# Altium project 3xVCO SMT.PrjPcb
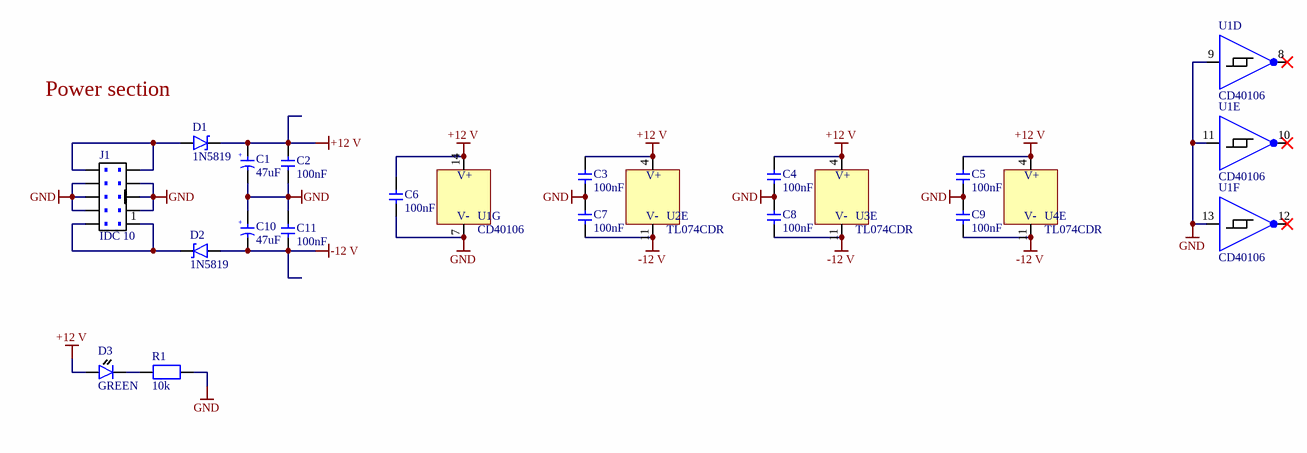
[diagram p0: Power section.SchDoc]
4 sheets, 122 parts. Net scope: global (net labels, ports and power ports of the same name join across sheets).
Board files: 3xVCO.PcbDoc, FrontPanel.PcbDoc
Sheets:
  Power section.SchDoc
  Saw VCO.SchDoc
  Blend VCO.SchDoc
  Triangle VCO.SchDoc

## Sheet Power section.SchDoc: 3x_VCO_board
size A3; Author: Jakub Orzechowski; Revision: 1.0; SheetNumber: 1; SheetTotal: 4

### Parts
C1  value 47uF  [Cap electrolytic THT 5mm]  (hidden comment: CAP)
C2  value 100nF  [Cap SMD 0805]  (hidden comment: CAP)
C3  value 100nF  [Cap SMD 0805]  (hidden comment: CAP)
C4  value 100nF  [Cap SMD 0805]  (hidden comment: CAP)
C5  value 100nF  [Cap SMD 0805]  (hidden comment: CAP)
C6  value 100nF  [Cap SMD 0805]  (hidden comment: CAP)
C7  value 100nF  [Cap SMD 0805]  (hidden comment: CAP)
C8  value 100nF  [Cap SMD 0805]  (hidden comment: CAP)
C9  value 100nF  [Cap SMD 0805]  (hidden comment: CAP)
C10  value 47uF  [Cap electrolytic THT 5mm]  (hidden comment: CAP)
C11  value 100nF  [Cap SMD 0805]  (hidden comment: CAP)
D1  Model: 1N5819  [Diode THT 10 mm]  (hidden comment: SCHOTTKY)
D2  Model: 1N5819  [Diode THT 10 mm]  (hidden comment: SCHOTTKY)
D3  Color: GREEN  [LED SMD 0805]  (hidden comment: LED)
J1  IDC 10  [IDC 10 PIN]
R1  value 10k  [Resistor SMD 0805]  (hidden comment: RES)
U1  CD40106  [DIP-14 socket]  (parts D,E,F,G of 7)
U2  TL074CDR  [SOIC14]  (part E of 5)
U3  TL074CDR  [SOIC14]  (part E of 5)
U4  TL074CDR  [SOIC14]  (part E of 5)

### Nets
+12 V: C1.2 C2.2 C3.2 C4.2 C5.2 C6.2 D1.2 D3.1 U1.14 U2.4 U3.4 U4.4
-12 V: C7.1 C8.1 C9.1 C10.1 C11.1 D2.1 U2.11 U3.11 U4.11
GND: C1.1 C2.1 C3.1 C4.1 C5.1 C6.1 C7.2 C8.2 C9.2 C10.2 C11.2 J1.3 J1.4 J1.5 J1.6 J1.7 J1.8 R1.2 U1.7 U1.9 U1.11 U1.13
NetD1_1: D1.1 J1.9 J1.10
NetD2_2: D2.2 J1.1 J1.2
NetD3_2: D3.2 R1.1

Not connected (* = marked no-connect by the designer): U1 8* 10* 12*

### Notes on the sheet
- (near D1) Power section
- PROJECT:
- SCHEMATIC:
- REV:
- DRAWN BY:
- DATE:
- FILENAME:
- SHEET:
- out of
- (in symbol Capacitor Electr THT 5mm) +
- (in symbol CD40106 DIP-14, part G) V+; V-
- (in symbol TL074CDR SOIC14, part E) V+; V-

### Library data of the parts
C1 C10 = Capacitor Electr THT 5mm: THT Electrolytic Capacitor 5 mm Diameter; Voltage rating: *; Tolerance: *; Package Type: THT
C2-C9 C11 = Capacitor SMD 0805: SMD Capacitor Non-Polarised 0805 Package; Voltage rating: *; Tolerance: *; Package Type: SMD
D1 D2 = Schottky Diode THT: Generic THT Axial Schottky Diode 10 mm Pitch; Max Reverse Voltage: *; Max Current: *; Package Type: THT; Type: Schottky
D3 = LED SMD: SMD LED Diode 0805 Package; Forward voltage: *; Package Type: SMD; Type: LED
J1 = IDC 10 pin: 10 Pin IDC Connector
R1 = Resistor SMD 0805: SMD Resistor 0805 package; Tolerance: *; Package Type: SMD
U1 = CD40106 DIP-14: CD40106 Hex Schmitt Trigger Inverter DIP-14 Package; Type: Schmitt Trigger; Package Type: THT; Package: DIP-14
U2-U4 = TL074CDR SOIC14: TL074CDR Quad Op-Amp SOIC14 Package; Type: Op Amp; Package Type: SMD; Package: SOIC14

## Sheet Saw VCO.SchDoc
size A3; SheetNumber: 2; SheetTotal: 4
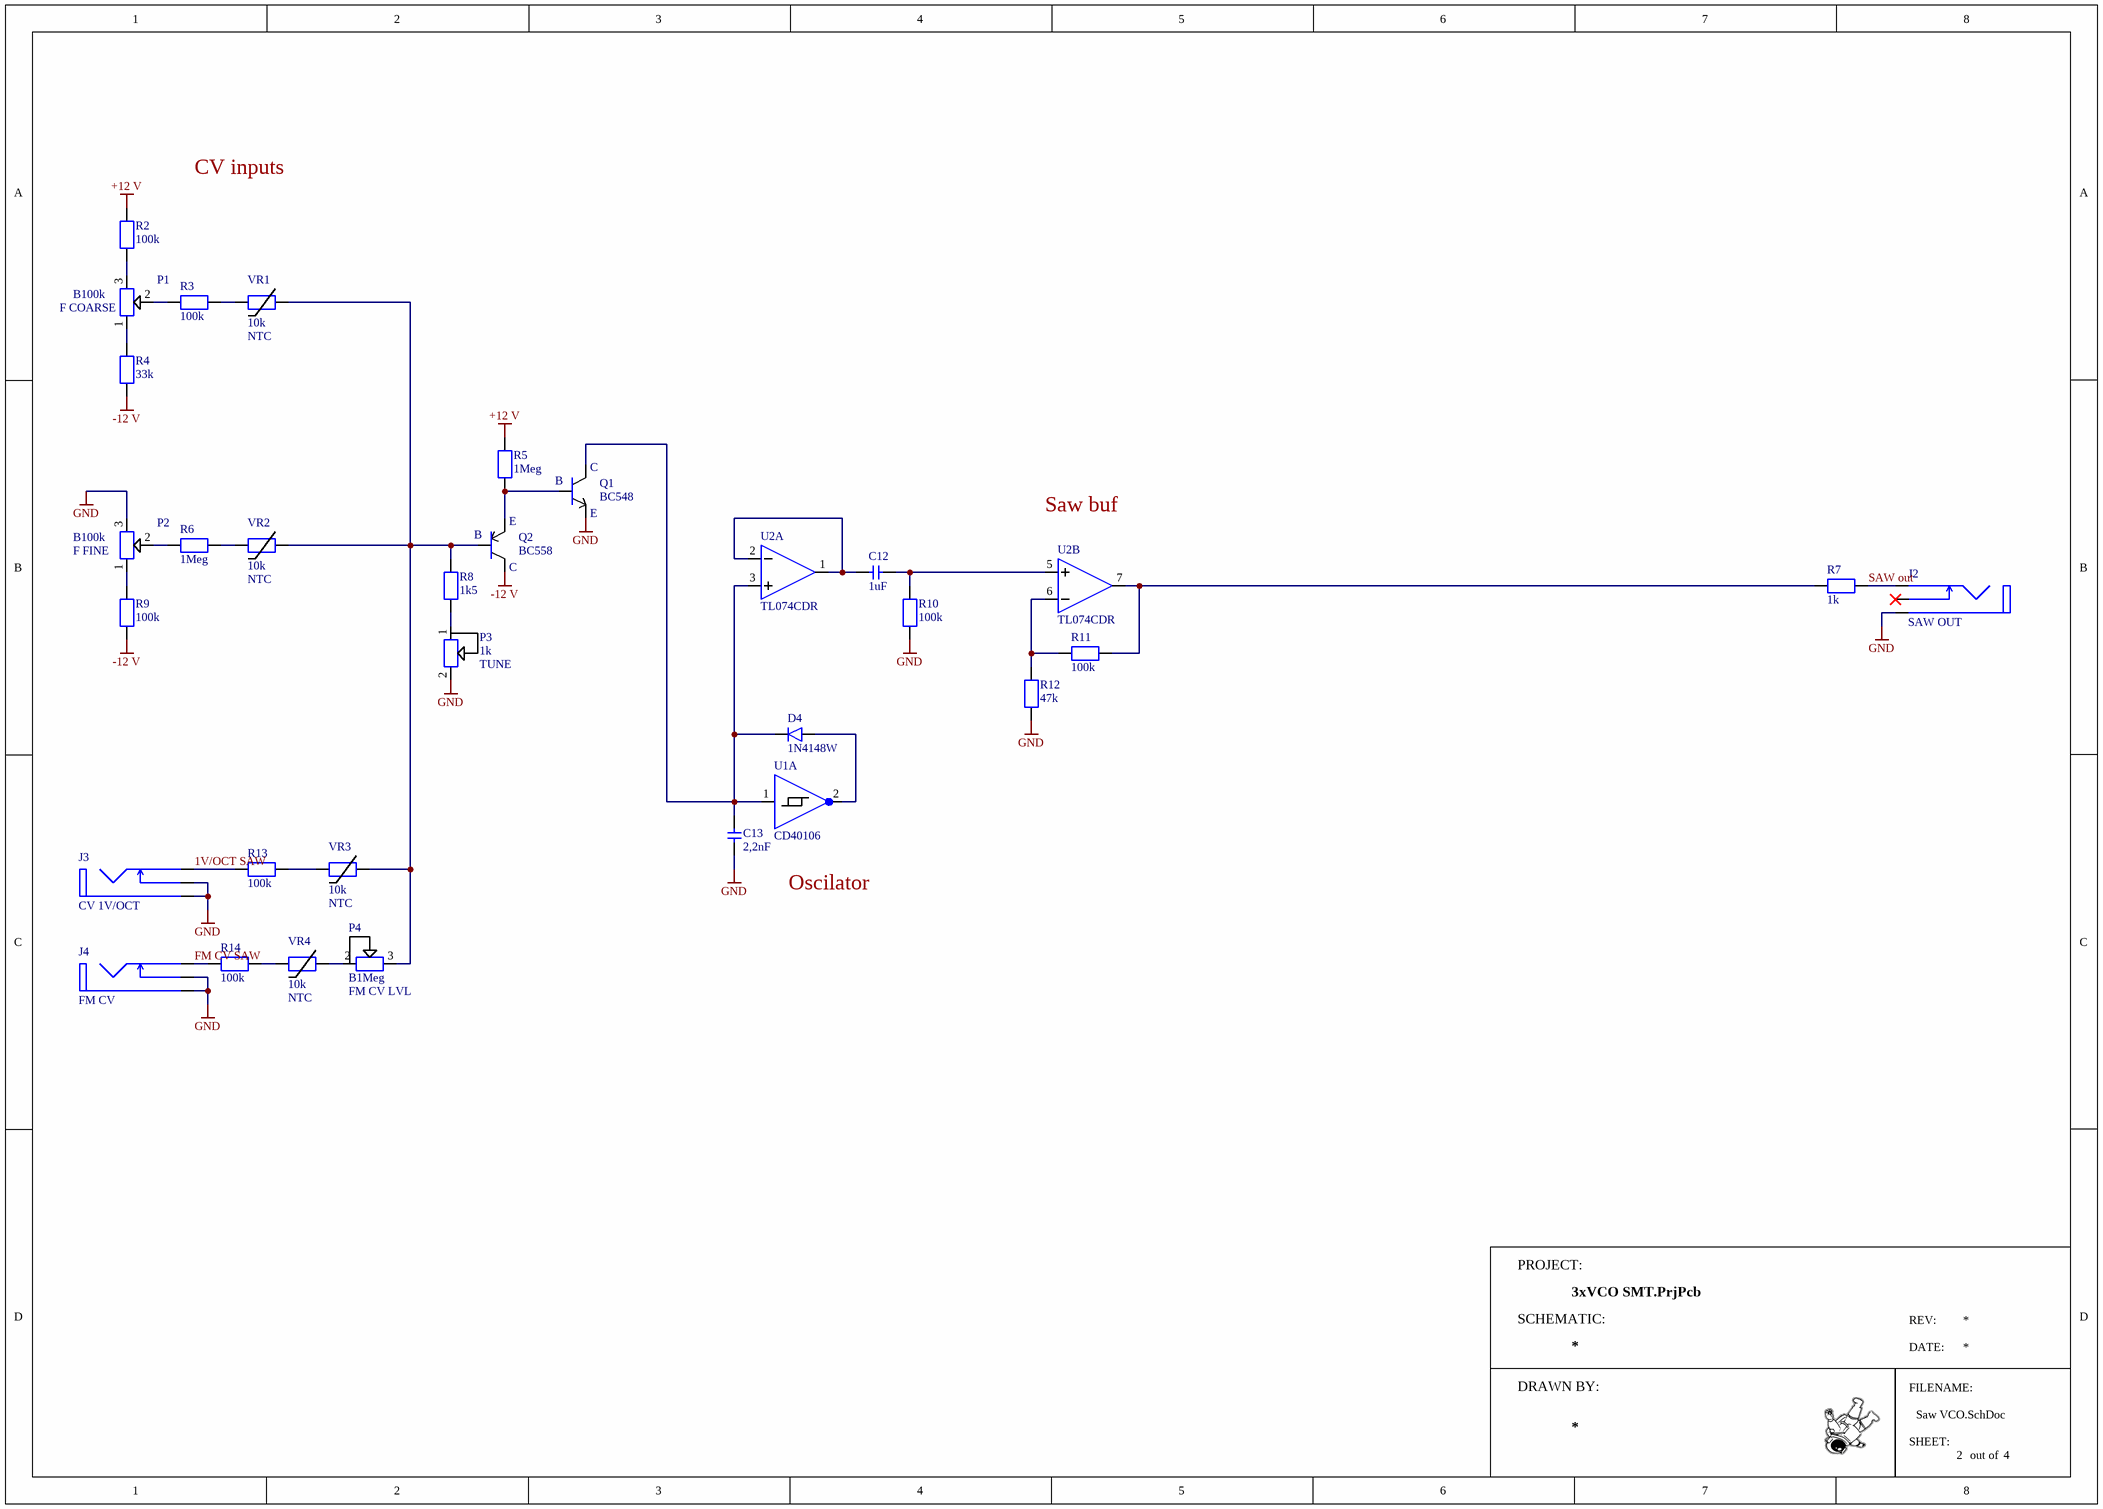
[diagram p1: Saw VCO.SchDoc]

### Parts
C12  value 1uF  [Cap SMD 0805]  (hidden comment: CAP)
C13  value 2,2nF  [Cap SMD 0805]  (hidden comment: CAP)
D4  Model: 1N4148W  [SOD-123]  (hidden comment: DIODE)
J2  Label: SAW OUT  [PJ301M]  (hidden comment: JACK Mono)
J3  Label: CV 1V/OCT  [PJ301M]  (hidden comment: JACK Mono)
J4  Label: FM CV  [PJ301M]  (hidden comment: JACK Mono)
P1  value B100k  Parameter: F COARSE  [9 mm PCB Potentiometer]  (hidden comment: Mono Pot)
P2  value B100k  Parameter: F FINE  [9 mm PCB Potentiometer]  (hidden comment: Mono Pot)
P3  value 1k  Parameter: TUNE  [Multiturn Potentiometer inline]  (hidden comment: VR)
P4  value B1Meg  Parameter: FM CV LVL  [9 mm PCB Potentiometer]  (hidden comment: VR)
Q1  BC548  [TO-92 wide]
Q2  BC558  [TO-92 wide]
R2  value 100k  [Resistor SMD 0805]  (hidden comment: RES)
R3  value 100k  [Resistor SMD 0805]  (hidden comment: RES)
R4  value 33k  [Resistor SMD 0805]  (hidden comment: RES)
R5  value 1Meg  [Resistor SMD 0805]  (hidden comment: RES)
R6  value 1Meg  [Resistor SMD 0805]  (hidden comment: RES)
R7  value 1k  [Resistor SMD 0805]  (hidden comment: RES)
R8  value 1k5  [Resistor SMD 0805]  (hidden comment: RES)
R9  value 100k  [Resistor SMD 0805]  (hidden comment: RES)
R10  value 100k  [Resistor SMD 0805]  (hidden comment: RES)
R11  value 100k  [Resistor SMD 0805]  (hidden comment: RES)
R12  value 47k  [Resistor SMD 0805]  (hidden comment: RES)
R13  value 100k  [Resistor SMD 0805]  (hidden comment: RES)
R14  value 100k  [Resistor SMD 0805]  (hidden comment: RES)
U1  CD40106  [DIP-14 socket]  (part A of 7)
U2  TL074CDR  [SOIC14]  (parts A,B of 5)
VR1  NTC  value 10k  [Thermistor SMD 0805]
VR2  NTC  value 10k  [Thermistor SMD 0805]
VR3  NTC  value 10k  [Thermistor SMD 0805]
VR4  NTC  value 10k  [Thermistor SMD 0805]

### Nets
+12 V: R2.2 R5.1
-12 V: Q2.1 R4.1 R9.1
GND: C13.1 J2.1 J3.1 J3.2 J4.1 J4.2 P2.3 P3.2 Q1.3 R10.2 R12.2
1V/OCT SAW: J3.3 R13.2
FM CV SAW: J4.3 R14.2
SAW out: J2.3 R7.2
NetC12_1: C12.1 R10.1 U2.5
NetC12_2: C12.2 U2.1 U2.2
NetC13_2: C13.2 D4.2 Q1.1 U1.1 U2.3
NetD4_1: D4.1 U1.2
NetP1_1: P1.1 R4.2
NetP1_2: P1.2 R3.2
NetP1_3: P1.3 R2.1
NetP2_1: P2.1 R9.2
NetP2_2: P2.2 R6.2
NetP3_1: P3.1 R8.2
NetP4_2: P4.2 VR4.2
NetP4_3: P4.3 Q2.2 R8.1 VR1.2 VR2.2 VR3.2
NetQ1_2: Q1.2 Q2.3 R5.2
NetR3_1: R3.1 VR1.1
NetR6_1: R6.1 VR2.1
NetR7_1: R7.1 R11.2 U2.7
NetR11_1: R11.1 R12.1 U2.6
NetR13_1: R13.1 VR3.1
NetR14_1: R14.1 VR4.1

Not connected (* = marked no-connect by the designer): J2 2*

### Notes on the sheet
- CV inputs
- Saw buf
- Oscilator
- PROJECT:
- SCHEMATIC:
- REV:
- DRAWN BY:
- DATE:
- FILENAME:
- SHEET:
- out of
- (in symbol BC548) C; B; E
- (in symbol BC558) E; B; C

### Library data of the parts
C12 C13 = Capacitor SMD 0805: SMD Capacitor Non-Polarised 0805 Package; Voltage rating: *; Tolerance: *; Package Type: SMD
D4 = Diode SMD SOD123: Generic SMD Diode SOD123 Package; Max reverse voltage: *; Max current: *; Forward voltage: *; Package Type: SMD; Type: Diode
J2-J4 = PJ301M: PJ301M Eurorack 3,5 mm Patch Socket PCB Mount; Package Type: THT
P1 P2 = Potentiometer 9 mm: PCB Mount 9mm Mono Potentiometer THT; Taper: *; Package Type: THT; Type: Potentiometer
P3 = VR A Multiturn THT: PCB Mount Multiturn Trimmer Potentiometer Top Adjustable as Variable Resistor Clockwise Increase; Taper: *; Package Type: THT; Type: Potentiometer
P4 = VR B 9 mm: PCB Mount 9mm Mono Potentiometer THT as Variable Resistor Clockwise Decrease; Taper: *; Package Type: THT; Type: Potentiometer
Q1 = BC548: BC548 NPN Transistor THT TO-92 Package; Package Type: THT; Type: NPN Transistor; Package: TO-92; Group: *
Q2 = BC558: BC558 PNP Transistor THT TO-92 Package; Package Type: THT; Type: PNP Transistor; Package: TO-92; Group: *
R2-R14 = Resistor SMD 0805: SMD Resistor 0805 package; Tolerance: *; Package Type: SMD
U1 = CD40106 DIP-14: as U1 on sheet Power section; Type: Schmitt Trigger; Package Type: THT; Package: DIP-14
U2 = TL074CDR SOIC14: TL074CDR Quad Op-Amp SOIC14 Package; Type: Op Amp; Package Type: SMD; Package: SOIC14
VR1-VR4 = Thermistor NTC SMD 0805: SMD NTC Thermistor 0805 package; Tolerance: *; Package Type: SMD

## Sheet Blend VCO.SchDoc
size A3; SheetNumber: 3; SheetTotal: 4
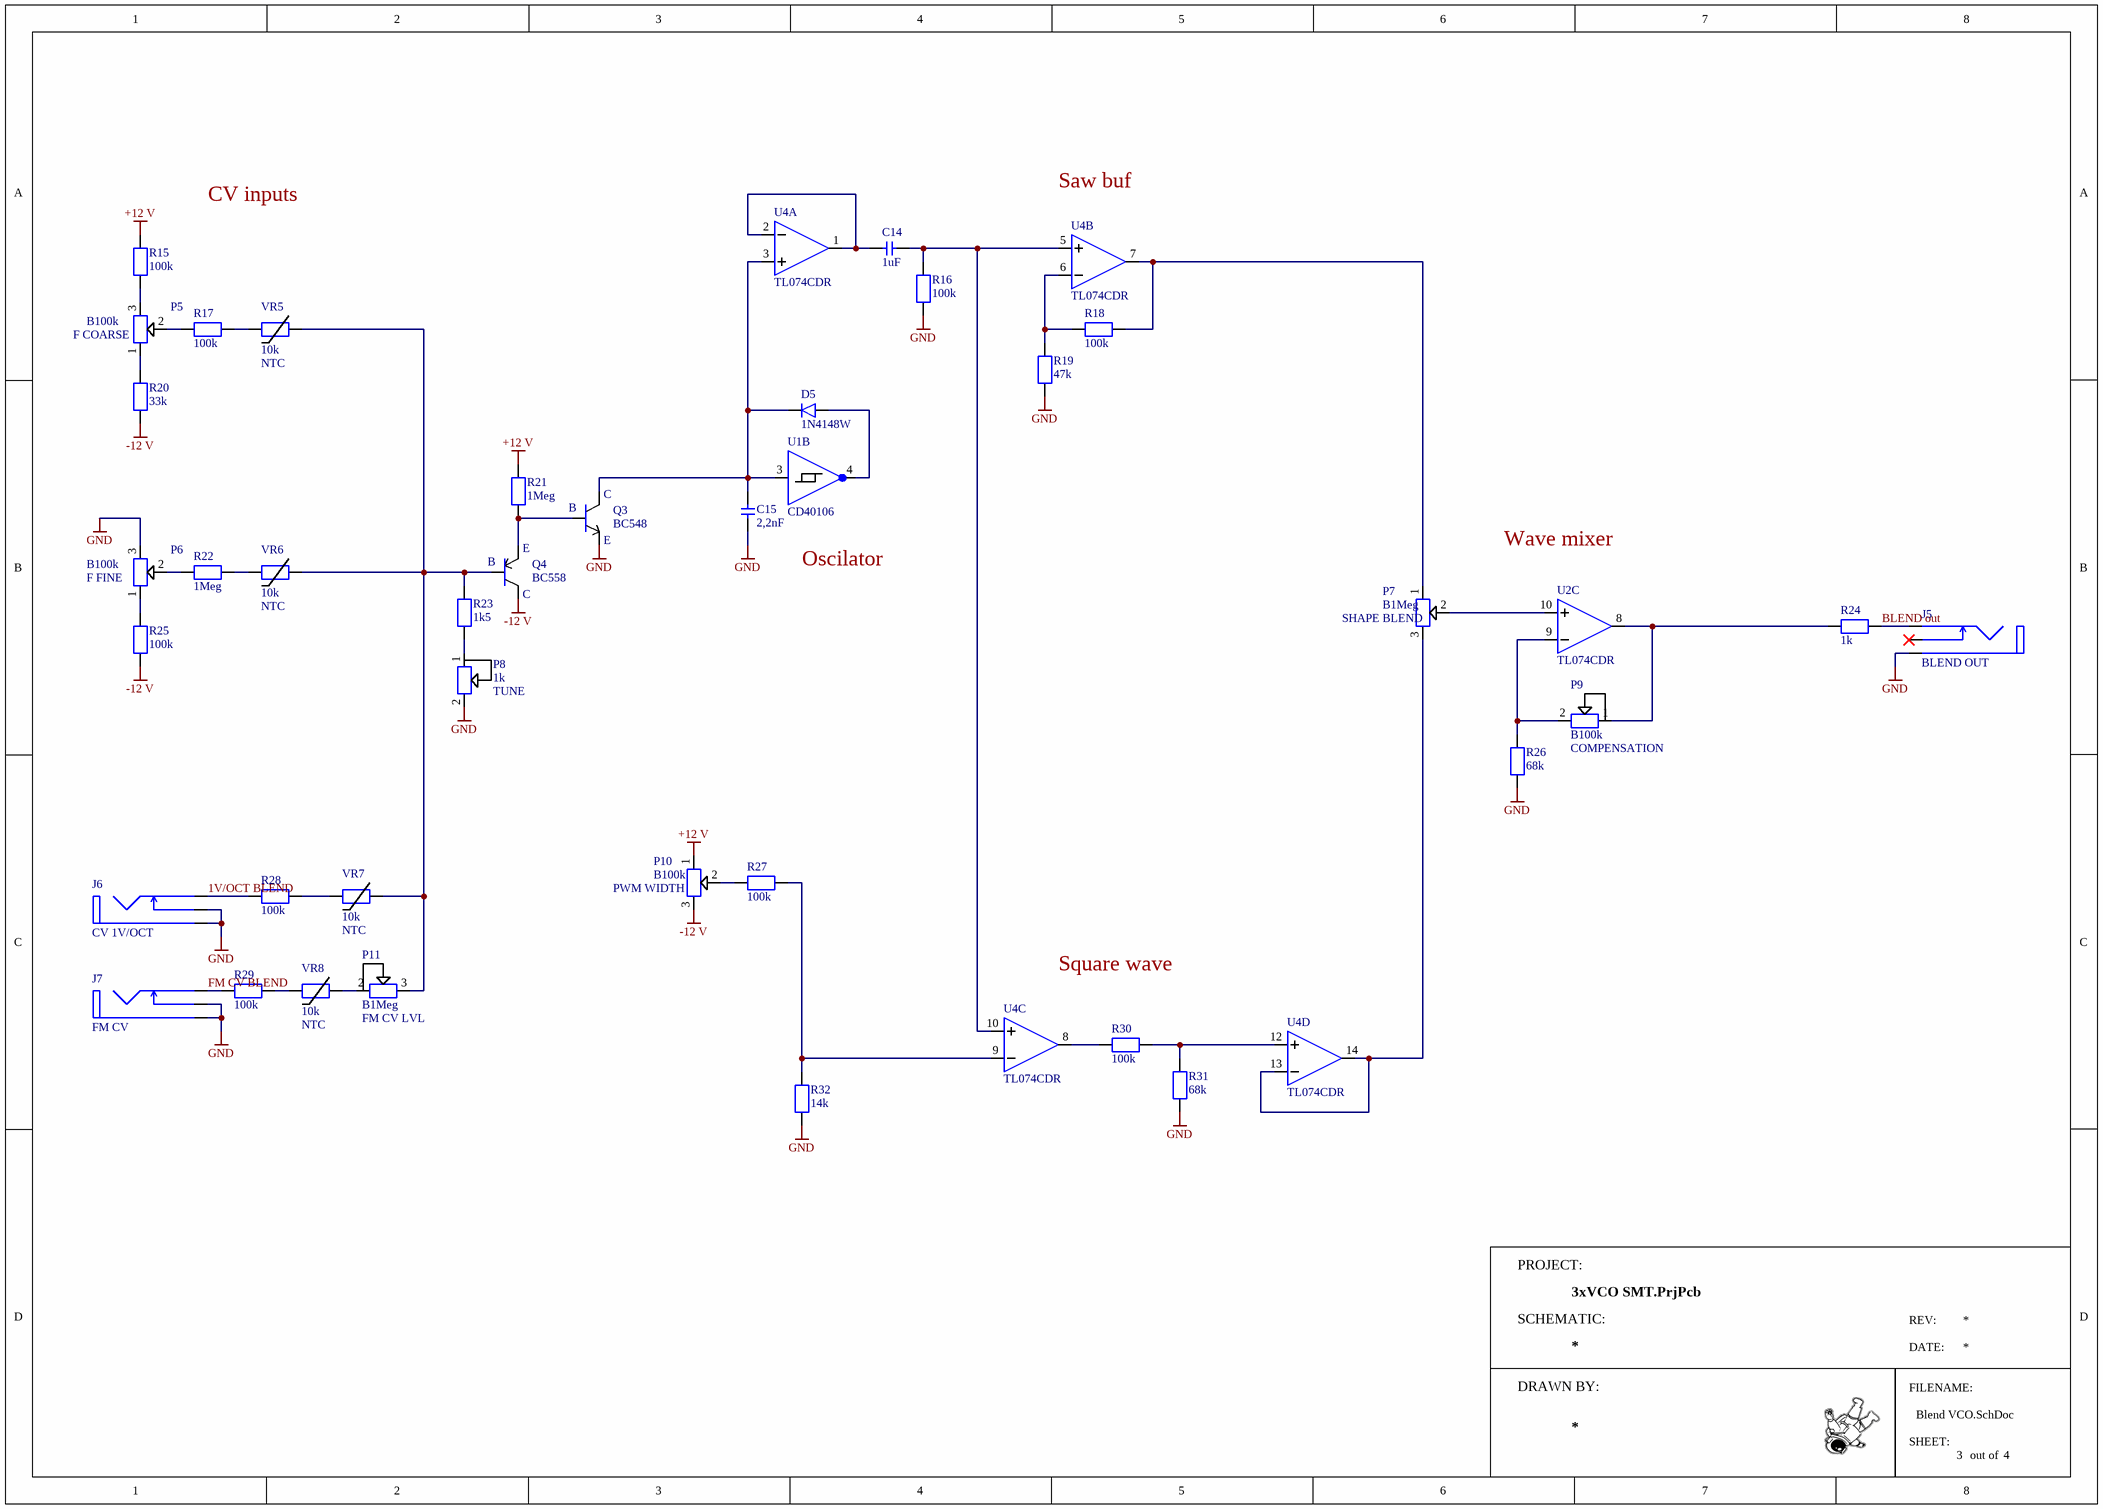
[diagram p2: Blend VCO.SchDoc]

### Parts
C14  value 1uF  [Cap SMD 0805]  (hidden comment: CAP)
C15  value 2,2nF  [Cap SMD 0805]  (hidden comment: CAP)
D5  Model: 1N4148W  [SOD-123]  (hidden comment: DIODE)
J5  Label: BLEND OUT  [PJ301M]  (hidden comment: JACK Mono)
J6  Label: CV 1V/OCT  [PJ301M]  (hidden comment: JACK Mono)
J7  Label: FM CV  [PJ301M]  (hidden comment: JACK Mono)
P5  value B100k  Parameter: F COARSE  [9 mm PCB Potentiometer]  (hidden comment: Mono Pot)
P6  value B100k  Parameter: F FINE  [9 mm PCB Potentiometer]  (hidden comment: Mono Pot)
P7  value B1Meg  Parameter: SHAPE BLEND  [9 mm PCB Potentiometer]  (hidden comment: Mono Pot)
P8  value 1k  Parameter: TUNE  [Multiturn Potentiometer inline]  (hidden comment: VR)
P9  value B100k  Parameter: COMPENSATION  [9 mm PCB Potentiometer]  (hidden comment: VR)
P10  value B100k  Parameter: PWM WIDTH  [9 mm PCB Potentiometer]  (hidden comment: Mono Pot)
P11  value B1Meg  Parameter: FM CV LVL  [9 mm PCB Potentiometer]  (hidden comment: VR)
Q3  BC548  [TO-92 wide]
Q4  BC558  [TO-92 wide]
R15  value 100k  [Resistor SMD 0805]  (hidden comment: RES)
R16  value 100k  [Resistor SMD 0805]  (hidden comment: RES)
R17  value 100k  [Resistor SMD 0805]  (hidden comment: RES)
R18  value 100k  [Resistor SMD 0805]  (hidden comment: RES)
R19  value 47k  [Resistor SMD 0805]  (hidden comment: RES)
R20  value 33k  [Resistor SMD 0805]  (hidden comment: RES)
R21  value 1Meg  [Resistor SMD 0805]  (hidden comment: RES)
R22  value 1Meg  [Resistor SMD 0805]  (hidden comment: RES)
R23  value 1k5  [Resistor SMD 0805]  (hidden comment: RES)
R24  value 1k  [Resistor SMD 0805]  (hidden comment: RES)
R25  value 100k  [Resistor SMD 0805]  (hidden comment: RES)
R26  value 68k  [Resistor SMD 0805]  (hidden comment: RES)
R27  value 100k  [Resistor SMD 0805]  (hidden comment: RES)
R28  value 100k  [Resistor SMD 0805]  (hidden comment: RES)
R29  value 100k  [Resistor SMD 0805]  (hidden comment: RES)
R30  value 100k  [Resistor SMD 0805]  (hidden comment: RES)
R31  value 68k  [Resistor SMD 0805]  (hidden comment: RES)
R32  value 14k  [Resistor SMD 0805]  (hidden comment: RES)
U1  CD40106  [DIP-14 socket]  (part B of 7)
U2  TL074CDR  [SOIC14]  (part C of 5)
U4  TL074CDR  [SOIC14]  (parts A,B,C,D of 5)
VR5  NTC  value 10k  [Thermistor SMD 0805]
VR6  NTC  value 10k  [Thermistor SMD 0805]
VR7  NTC  value 10k  [Thermistor SMD 0805]
VR8  NTC  value 10k  [Thermistor SMD 0805]

### Nets
+12 V: P10.1 R15.2 R21.1
-12 V: P10.3 Q4.1 R20.1 R25.1
GND: C15.1 J5.1 J6.1 J6.2 J7.1 J7.2 P6.3 P8.2 Q3.3 R16.2 R19.2 R26.1 R31.1 R32.1
1V/OCT BLEND: J6.3 R28.2
BLEND out: J5.3 R24.2
FM CV BLEND: J7.3 R29.2
NetC14_1: C14.1 R16.1 U4.5 U4.10
NetC14_2: C14.2 U4.1 U4.2
NetC15_2: C15.2 D5.2 Q3.1 U1.3 U4.3
NetD5_1: D5.1 U1.4
NetP5_1: P5.1 R20.2
NetP5_2: P5.2 R17.2
NetP5_3: P5.3 R15.1
NetP6_1: P6.1 R25.2
NetP6_2: P6.2 R22.2
NetP7_1: P7.1 R18.2 U4.7
NetP7_2: P7.2 U2.10
NetP7_3: P7.3 U4.13 U4.14
NetP8_1: P8.1 R23.2
NetP9_1: P9.1 R24.1 U2.8
NetP9_2: P9.2 R26.2 U2.9
NetP10_2: P10.2 R27.1
NetP11_2: P11.2 VR8.2
NetP11_3: P11.3 Q4.2 R23.1 VR5.2 VR6.2 VR7.2
NetQ3_2: Q3.2 Q4.3 R21.2
NetR17_1: R17.1 VR5.1
NetR18_1: R18.1 R19.1 U4.6
NetR22_1: R22.1 VR6.1
NetR27_2: R27.2 R32.2 U4.9
NetR28_1: R28.1 VR7.1
NetR29_1: R29.1 VR8.1
NetR30_1: R30.1 U4.8
NetR30_2: R30.2 R31.2 U4.12

Not connected (* = marked no-connect by the designer): J5 2*

### Notes on the sheet
- CV inputs
- Saw buf
- Oscilator
- Wave mixer
- Square wave
- PROJECT:
- SCHEMATIC:
- REV:
- DRAWN BY:
- DATE:
- FILENAME:
- SHEET:
- out of
- (in symbol BC548) C; B; E
- (in symbol BC558) E; B; C

### Library data of the parts
C14 C15 = Capacitor SMD 0805: SMD Capacitor Non-Polarised 0805 Package; Voltage rating: *; Tolerance: *; Package Type: SMD
D5 = Diode SMD SOD123: Generic SMD Diode SOD123 Package; Max reverse voltage: *; Max current: *; Forward voltage: *; Package Type: SMD; Type: Diode
J5-J7 = PJ301M: as J2 on sheet Saw VCO; Package Type: THT
P5-P7 P10 = Potentiometer 9 mm: PCB Mount 9mm Mono Potentiometer THT; Taper: *; Package Type: THT; Type: Potentiometer
P8 = VR A Multiturn THT: as P3 on sheet Saw VCO; Taper: *; Package Type: THT; Type: Potentiometer
P9 = VR A 9 mm: PCB Mount 9mm Mono Potentiometer THT as Variable Resistor Clockwise Increase; Taper: *; Package Type: THT; Type: Potentiometer
P11 = VR B 9 mm: as P4 on sheet Saw VCO; Taper: *; Package Type: THT; Type: Potentiometer
Q3 = BC548: BC548 NPN Transistor THT TO-92 Package; Package Type: THT; Type: NPN Transistor; Package: TO-92; Group: *
Q4 = BC558: BC558 PNP Transistor THT TO-92 Package; Package Type: THT; Type: PNP Transistor; Package: TO-92; Group: *
R15-R32 = Resistor SMD 0805: SMD Resistor 0805 package; Tolerance: *; Package Type: SMD
U1 = CD40106 DIP-14: as U1 on sheet Power section; Type: Schmitt Trigger; Package Type: THT; Package: DIP-14
U2 U4 = TL074CDR SOIC14: TL074CDR Quad Op-Amp SOIC14 Package; Type: Op Amp; Package Type: SMD; Package: SOIC14
VR5-VR8 = Thermistor NTC SMD 0805: SMD NTC Thermistor 0805 package; Tolerance: *; Package Type: SMD

## Sheet Triangle VCO.SchDoc
size A3; SheetNumber: 4; SheetTotal: 4
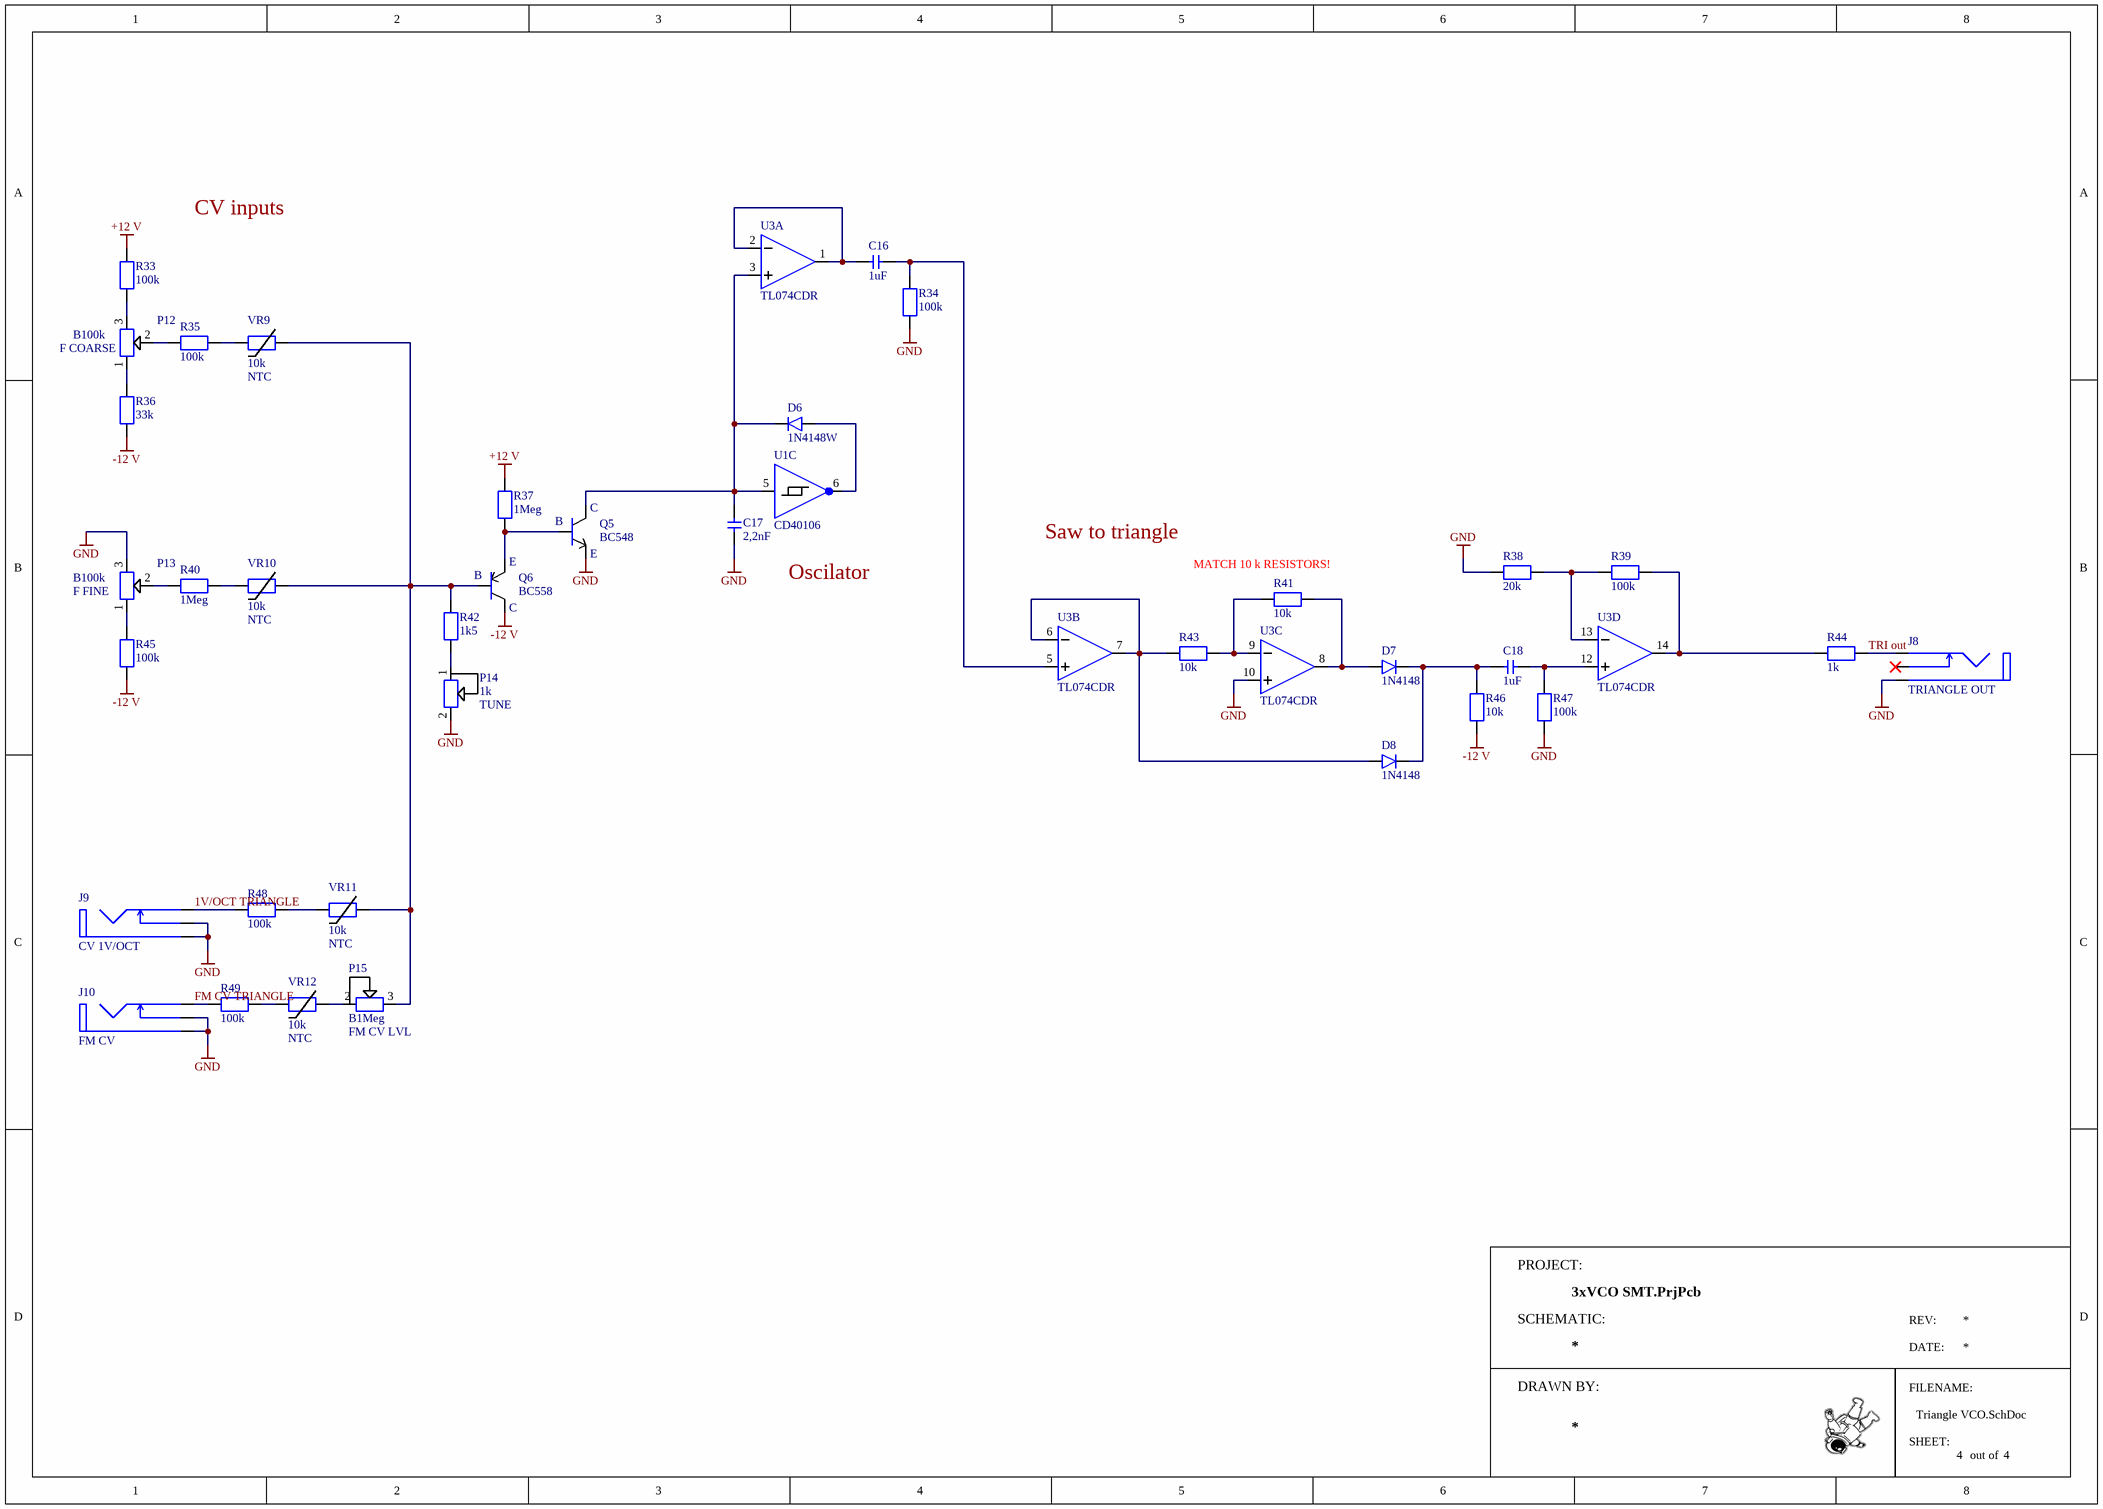
[diagram p3: Triangle VCO.SchDoc]

### Parts
C16  value 1uF  [Cap SMD 0805]  (hidden comment: CAP)
C17  value 2,2nF  [Cap SMD 0805]  (hidden comment: CAP)
C18  value 1uF  [Cap SMD 0805]  (hidden comment: CAP)
D6  Model: 1N4148W  [SOD-123]  (hidden comment: DIODE)
D7  Model: 1N4148  [Diode THT 10 mm]  (hidden comment: DIODE)
D8  Model: 1N4148  [Diode THT 10 mm]  (hidden comment: DIODE)
J8  Label: TRIANGLE OUT  [PJ301M]  (hidden comment: JACK Mono)
J9  Label: CV 1V/OCT  [PJ301M]  (hidden comment: JACK Mono)
J10  Label: FM CV  [PJ301M]  (hidden comment: JACK Mono)
P12  value B100k  Parameter: F COARSE  [9 mm PCB Potentiometer]  (hidden comment: Mono Pot)
P13  value B100k  Parameter: F FINE  [9 mm PCB Potentiometer]  (hidden comment: Mono Pot)
P14  value 1k  Parameter: TUNE  [Multiturn Potentiometer inline]  (hidden comment: VR)
P15  value B1Meg  Parameter: FM CV LVL  [9 mm PCB Potentiometer]  (hidden comment: VR)
Q5  BC548  [TO-92 wide]
Q6  BC558  [TO-92 wide]
R33  value 100k  [Resistor SMD 0805]  (hidden comment: RES)
R34  value 100k  [Resistor SMD 0805]  (hidden comment: RES)
R35  value 100k  [Resistor SMD 0805]  (hidden comment: RES)
R36  value 33k  [Resistor SMD 0805]  (hidden comment: RES)
R37  value 1Meg  [Resistor SMD 0805]  (hidden comment: RES)
R38  value 20k  [Resistor SMD 0805]  (hidden comment: RES)
R39  value 100k  [Resistor SMD 0805]  (hidden comment: RES)
R40  value 1Meg  [Resistor SMD 0805]  (hidden comment: RES)
R41  value 10k  [Resistor THT vertical]  (hidden comment: RES)
R42  value 1k5  [Resistor SMD 0805]  (hidden comment: RES)
R43  value 10k  [Resistor THT vertical]  (hidden comment: RES)
R44  value 1k  [Resistor SMD 0805]  (hidden comment: RES)
R45  value 100k  [Resistor SMD 0805]  (hidden comment: RES)
R46  value 10k  [Resistor SMD 0805]  (hidden comment: RES)
R47  value 100k  [Resistor SMD 0805]  (hidden comment: RES)
R48  value 100k  [Resistor SMD 0805]  (hidden comment: RES)
R49  value 100k  [Resistor SMD 0805]  (hidden comment: RES)
U1  CD40106  [DIP-14 socket]  (part C of 7)
U3  TL074CDR  [SOIC14]  (parts A,B,C,D of 5)
VR9  NTC  value 10k  [Thermistor SMD 0805]
VR10  NTC  value 10k  [Thermistor SMD 0805]
VR11  NTC  value 10k  [Thermistor SMD 0805]
VR12  NTC  value 10k  [Thermistor SMD 0805]

### Nets
+12 V: R33.2 R37.1
-12 V: Q6.1 R36.1 R45.1 R46.2
GND: C17.1 J8.1 J9.1 J9.2 J10.1 J10.2 P13.3 P14.2 Q5.3 R34.2 R38.1 R47.2 U3.10
1V/OCT TRIANGLE: J9.3 R48.2
FM CV TRIANGLE: J10.3 R49.2
TRI out: J8.3 R44.2
NetC16_1: C16.1 R34.1 U3.5
NetC16_2: C16.2 U3.1 U3.2
NetC17_2: C17.2 D6.2 Q5.1 U1.5 U3.3
NetC18_1: C18.1 R47.1 U3.12
NetC18_2: C18.2 D7.2 D8.2 R46.1
NetD6_1: D6.1 U1.6
NetD7_1: D7.1 R41.2 U3.8
NetD8_1: D8.1 R43.1 U3.6 U3.7
NetP12_1: P12.1 R36.2
NetP12_2: P12.2 R35.2
NetP12_3: P12.3 R33.1
NetP13_1: P13.1 R45.2
NetP13_2: P13.2 R40.2
NetP14_1: P14.1 R42.2
NetP15_2: P15.2 VR12.2
NetP15_3: P15.3 Q6.2 R42.1 VR9.2 VR10.2 VR11.2
NetQ5_2: Q5.2 Q6.3 R37.2
NetR35_1: R35.1 VR9.1
NetR38_2: R38.2 R39.1 U3.13
NetR39_2: R39.2 R44.1 U3.14
NetR40_1: R40.1 VR10.1
NetR41_1: R41.1 R43.2 U3.9
NetR48_1: R48.1 VR11.1
NetR49_1: R49.1 VR12.1

Not connected (* = marked no-connect by the designer): J8 2*

### Notes on the sheet
- CV inputs
- Oscilator
- Saw to triangle
- (near R41) MATCH 10 k RESISTORS!
- PROJECT:
- SCHEMATIC:
- REV:
- DRAWN BY:
- DATE:
- FILENAME:
- SHEET:
- out of
- (in symbol BC548) C; B; E
- (in symbol BC558) E; B; C

### Library data of the parts
C16-C18 = Capacitor SMD 0805: SMD Capacitor Non-Polarised 0805 Package; Voltage rating: *; Tolerance: *; Package Type: SMD
D6 = Diode SMD SOD123: Generic SMD Diode SOD123 Package; Max reverse voltage: *; Max current: *; Forward voltage: *; Package Type: SMD; Type: Diode
D7 D8 = Diode THT: Generic THT Axial Diode 10 mm Pitch; Max reverse voltage: *; Max current: *; Forward voltage: *; Package Type: THT; Type: Diode
J8-J10 = PJ301M: as J2 on sheet Saw VCO; Package Type: THT
P12 P13 = Potentiometer 9 mm: PCB Mount 9mm Mono Potentiometer THT; Taper: *; Package Type: THT; Type: Potentiometer
P14 = VR A Multiturn THT: as P3 on sheet Saw VCO; Taper: *; Package Type: THT; Type: Potentiometer
P15 = VR B 9 mm: as P4 on sheet Saw VCO; Taper: *; Package Type: THT; Type: Potentiometer
Q5 = BC548: BC548 NPN Transistor THT TO-92 Package; Package Type: THT; Type: NPN Transistor; Package: TO-92; Group: *
Q6 = BC558: BC558 PNP Transistor THT TO-92 Package; Package Type: THT; Type: PNP Transistor; Package: TO-92; Group: *
R33-R40 R42 R44-R49 = Resistor SMD 0805: SMD Resistor 0805 package; Tolerance: *; Package Type: SMD
R41 R43 = Resistor THT: THT Axial Resistor 10mm Pitch; Tolerance: *; Package Type: THT
U1 = CD40106 DIP-14: as U1 on sheet Power section; Type: Schmitt Trigger; Package Type: THT; Package: DIP-14
U3 = TL074CDR SOIC14: TL074CDR Quad Op-Amp SOIC14 Package; Type: Op Amp; Package Type: SMD; Package: SOIC14
VR9-VR12 = Thermistor NTC SMD 0805: SMD NTC Thermistor 0805 package; Tolerance: *; Package Type: SMD

## Nets that join several sheets
+12 V: Power section (12 pins), Saw VCO (R2.2 R5.1), Blend VCO (P10.1 R15.2 R21.1), Triangle VCO (R33.2 R37.1)
-12 V: Power section (9 pins), Saw VCO (Q2.1 R4.1 R9.1), Blend VCO (P10.3 Q4.1 R20.1 R25.1), Triangle VCO (Q6.1 R36.1 R45.1 R46.2)
GND: Power section (22 pins), Saw VCO (11 pins), Blend VCO (14 pins), Triangle VCO (13 pins)